# Altium schematic sheet STM32G4_V2.SchDoc
size A2; SheetNumber: 1; SheetTotal: 1
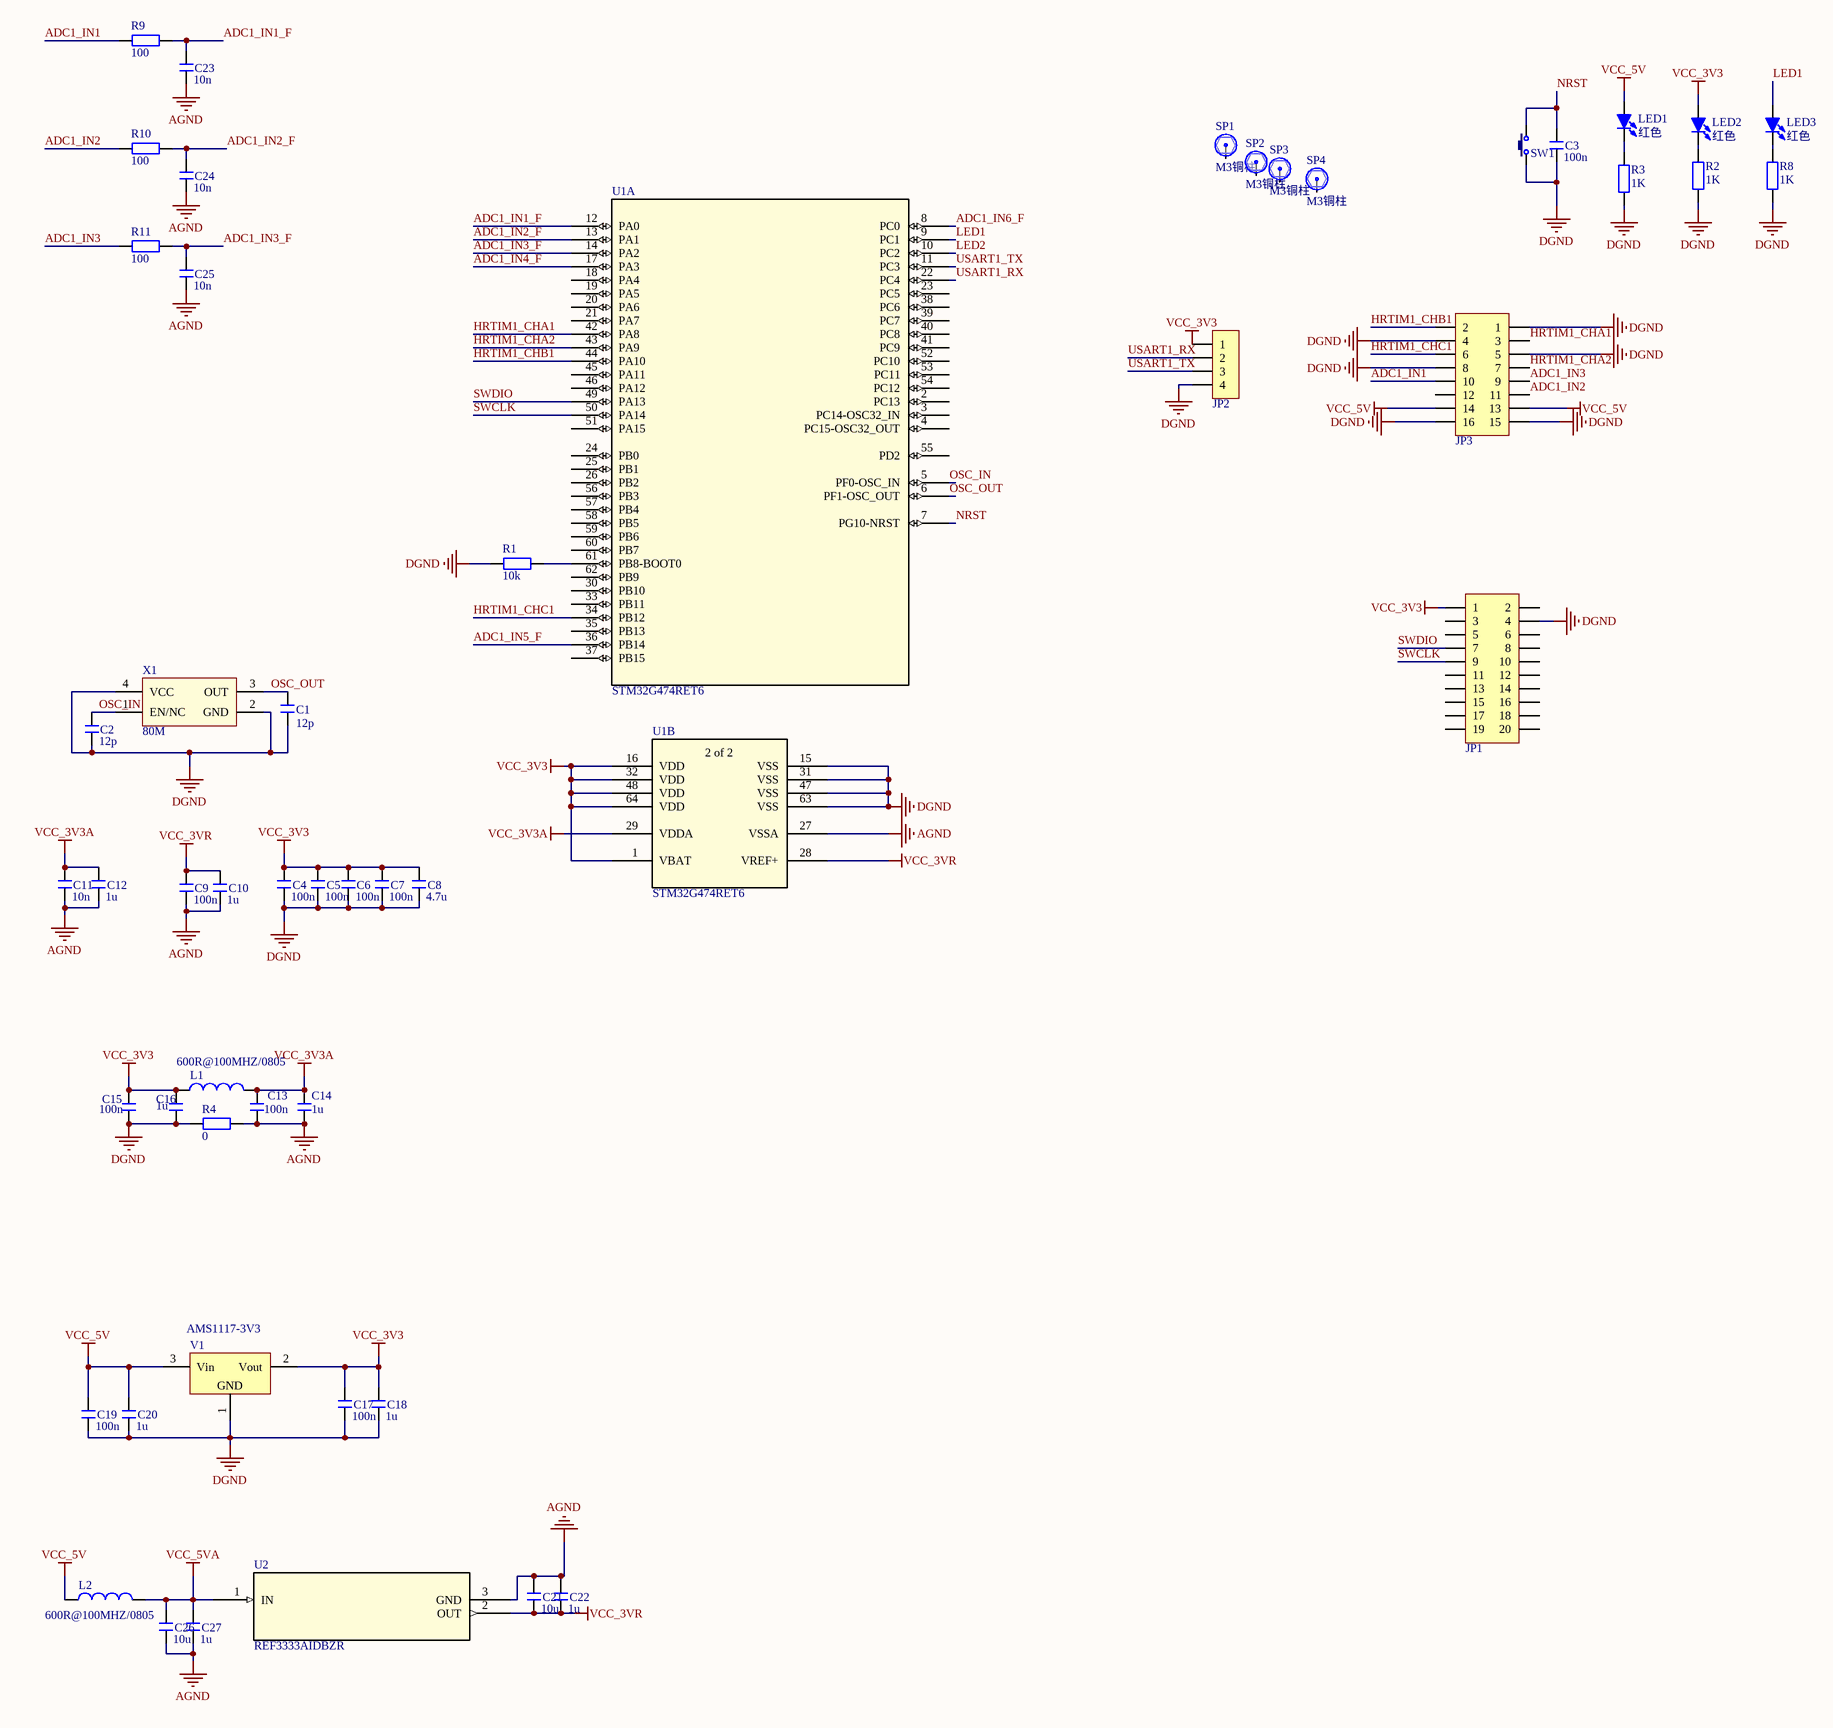
[diagram p0: STM32G4_V2.SchDoc]

## Parts
C1  12p  [C 0603_L]
C2  12p  [C 0603_L]
C3  100n  [C 0603_L]
C4  100n  [C 0603_L]
C5  100n  [C 0603_L]
C6  100n  [C 0603_L]
C7  100n  [C 0603_L]
C8  4.7u  [C 0603_L]
C9  100n  [C 0603_L]
C10  1u  [C 0603_L]
C11  10n  [C 0603_L]
C12  1u  [C 0603_L]
C13  100n  [C 0603_L]
C14  1u  [C 0603_L]
C15  100n  [C 0603_L]
C16  1u  [C 0603_L]
C17  100n  [C 0603_L]
C18  1u  [C 0603_L]
C19  100n  [C 0603_L]
C20  1u  [C 0603_L]
C21  10u  [C 0603_L]
C22  1u  [C 0603_L]
C23  10n  [C 0603_L]
C24  10n  [C 0603_L]
C25  10n  [C 0603_L]
C26  10u  [C 0603_L]
C27  1u  [C 0603_L]
JP1  Header 2X10  [IDC2.54-LI-2x10P]  (value not drawn)
JP2  HDR-1X4  [XH2.54-LI-4P]  (value not drawn)
JP3  Header 8X2  [HDR2.54-WI-2x8P]  (value not drawn)
L1  600R@100MHZ/0805  [L 0805_L]
L2  600R@100MHZ/0805  [L 0805_L]
LED1  红色  [LED 0805G]
LED2  红色  [LED 0805G]
LED3  红色  [LED 0805G]
R1  10k  [R 0603_L]
R2  1K  [R 0603_L]
R3  1K  [R 0603_L]
R4  0  [R 0603_L]
R8  1K  [R 0603_L]
R9  100  [R 0603_L]
R10  100  [R 0603_L]
R11  100  [R 0603_L]
SP1  M3铜柱  [M3x4_L]
SP2  M3铜柱  [M3x4_L]
SP3  M3铜柱  [M3x4_L]
SP4  M3铜柱  [M3x4_L]
SW1  3x6x5  [TSW SMD-3*6*2.5]  (value not drawn)
U1  STM32G474RET6  [LQFP64-10x10mm]  (parts A,B of 2)
U2  REF3333AIDBZR  [DBZ3]
V1  AMS1117-3V3  [SOT223_L]
X1  80M  [OSC 3225-4P]

## Nets
AGND: C9.2 C10.2 C11.2 C12.2 C13.2 C14.2 C21.1 C22.1 C23.2 C24.2 C25.2 C26.2 C27.2 R4.1 U1.27(VSSA) U2.3(GND)
DGND: C1.1 C2.2 C3.2 C4.2 C5.2 C6.2 C7.2 C8.2 C15.2 C16.2 C17.2 C18.2 C19.2 C20.2 JP1.4 JP2.4 JP3.1 JP3.4 JP3.5 JP3.8 JP3.15 JP3.16 R1.2 R2.1 R3.1 R4.2 R8.1 SW1.1 U1.15(VSS) U1.31(VSS) U1.47(VSS) U1.63(VSS) V1.1(GND) X1.2(GND) X1.4(VCC)
VCC_3V3: C4.1 C5.1 C6.1 C7.1 C8.1 C15.1 C16.1 C17.1 C18.1 JP1.1 JP2.1 L1.1 LED2.1(A) U1.1(VBAT) U1.16(VDD) U1.32(VDD) U1.48(VDD) U1.64(VDD) V1.2(Vout)
VCC_3V3A: C11.1 C12.1 C13.1 C14.1 L1.2 U1.29(VDDA)
VCC_3VR: C9.1 C10.1 C21.2 C22.2 U1.28(VREF+) U2.2(OUT)
VCC_5V: C19.1 C20.1 JP3.13 JP3.14 L2.1 LED1.1(A) V1.3(Vin)
VCC_5VA: C26.1 C27.1 L2.2 U2.1(IN)
ADC1_IN1: JP3.10 R9.2
ADC1_IN1_F: C23.1 R9.1 U1.12(PA0)
ADC1_IN2: JP3.11 R10.2
ADC1_IN2_F: C24.1 R10.1 U1.13(PA1)
ADC1_IN3: JP3.9 R11.2
ADC1_IN3_F: C25.1 R11.1 U1.14(PA2)
ADC1_IN4_F: U1.17(PA3)
ADC1_IN5_F: U1.36(PB14)
ADC1_IN6_F: U1.8(PC0)
HRTIM1_CHA1: JP3.3 U1.42(PA8)
HRTIM1_CHA2: JP3.7 U1.43(PA9)
HRTIM1_CHB1: JP3.2 U1.44(PA10)
HRTIM1_CHC1: JP3.6 U1.34(PB12)
LED1: LED3.1(A) U1.9(PC1)
LED2: U1.10(PC2)
NRST: C3.1 SW1.2 U1.7(PG10-NRST)
OSC_IN: C2.1 U1.5(PF0-OSC_IN) X1.1(EN/NC)
OSC_OUT: C1.2 U1.6(PF1-OSC_OUT) X1.3(OUT)
SWCLK: JP1.9 U1.50(PA14)
SWDIO: JP1.7 U1.49(PA13)
USART1_RX: JP2.2 U1.22(PC4)
USART1_TX: JP2.3 U1.11(PC3)
NetLED1_2: LED1.2(K) R3.2
NetLED2_2: LED2.2(K) R2.2
NetLED3_2: LED3.2(K) R8.2
NetR1_1: R1.1 U1.61(PB8-BOOT0)

Not connected (* = marked no-connect by the designer): JP1 2 3 5 6 8 10 11 12 13 14 15 16 17 18 19 20; JP3 12; SP1 1; SP2 1; SP3 1; SP4 1; U1 2(PC13) 3(PC14-OSC32_IN) 4(PC15-OSC32_OUT) 18(PA4) 19(PA5) 20(PA6) 21(PA7) 23(PC5) 24(PB0) 25(PB1) 26(PB2) 30(PB10) 33(PB11) 35(PB13) 37(PB15) 38(PC6) 39(PC7) 40(PC8) 41(PC9) 45(PA11) 46(PA12) 51(PA15) 52(PC10) 53(PC11) 54(PC12) 55(PD2) 56(PB3) 57(PB4) 58(PB5) 59(PB6) 60(PB7) 62(PB9)

## Notes on the sheet
- (in symbol STM32G474RET6, part B) 2 of 2

## Library data of the parts
C1-C27 = C: 无极性贴片电容; 版权归属: 源创客; 材质: X7R; BOM名称: 无极性贴片电容; 学习资源: www.ooocke.com
JP1 = Header 10X2: 10*2P接插件; 版权归属: 源创客; BOM名称: 10*2P接插件; 学习资源: www.ooocke.com
JP2 = Header 4: 4P接插件; 版权归属: 源创客; BOM名称: 4P接插件; 学习资源: www.ooocke.com
JP3 = Header 8X2: 8*2P接插件; 版权归属: 源创客; BOM名称: 8*2P接插件; 学习资源: www.ooocke.com
L1 L2 = L: 小功率贴片电感; 版权归属: 源创客; BOM名称: 小功率贴片电感; 学习资源: www.ooocke.com
LED1-LED3 = LED-SMD: 贴片LED; 版权归属: 源创客; BOM名称: 贴片LED; 学习资源: www.ooocke.com
R1-R4 R8-R11 = R: 贴片电阻; 版权归属: 源创客; BOM名称: 贴片电阻; 学习资源: www.ooocke.com
SP1-SP4 = 铜柱小焊盘: 铜柱; 版权归属: 源创客; BOM名称: 铜柱; 学习资源: www.ooocke.com
SW1 = TSW 3x6: 3x6轻触开关; 版权归属: 源创客; BOM名称: 3x6轻触开关; 学习资源: www.ooocke.com
U1 = STM32G474RET6: No Description Available; Mfr_Name: STMicroelectronics; RefDes: RefDes; Type: Type
U2 = REF3333AIDBZR: No Description Available; Mfr_Name: Texas Instruments; RefDes: RefDes; Type: Type
V1 = AMS1117: 三端稳压芯片; BOM名称: 稳压芯片; 版权归属: 源创客; 学习资源: www.ooocke.com
X1 = XTAL-ACT-4P: 4脚有源晶振; 版权归属: 源创客; BOM名称: 4脚有源晶振; 学习资源: www.ooocke.com